# EAGLE design CircularDisplayPrototypingBoard (EAGLE 9.6.2)
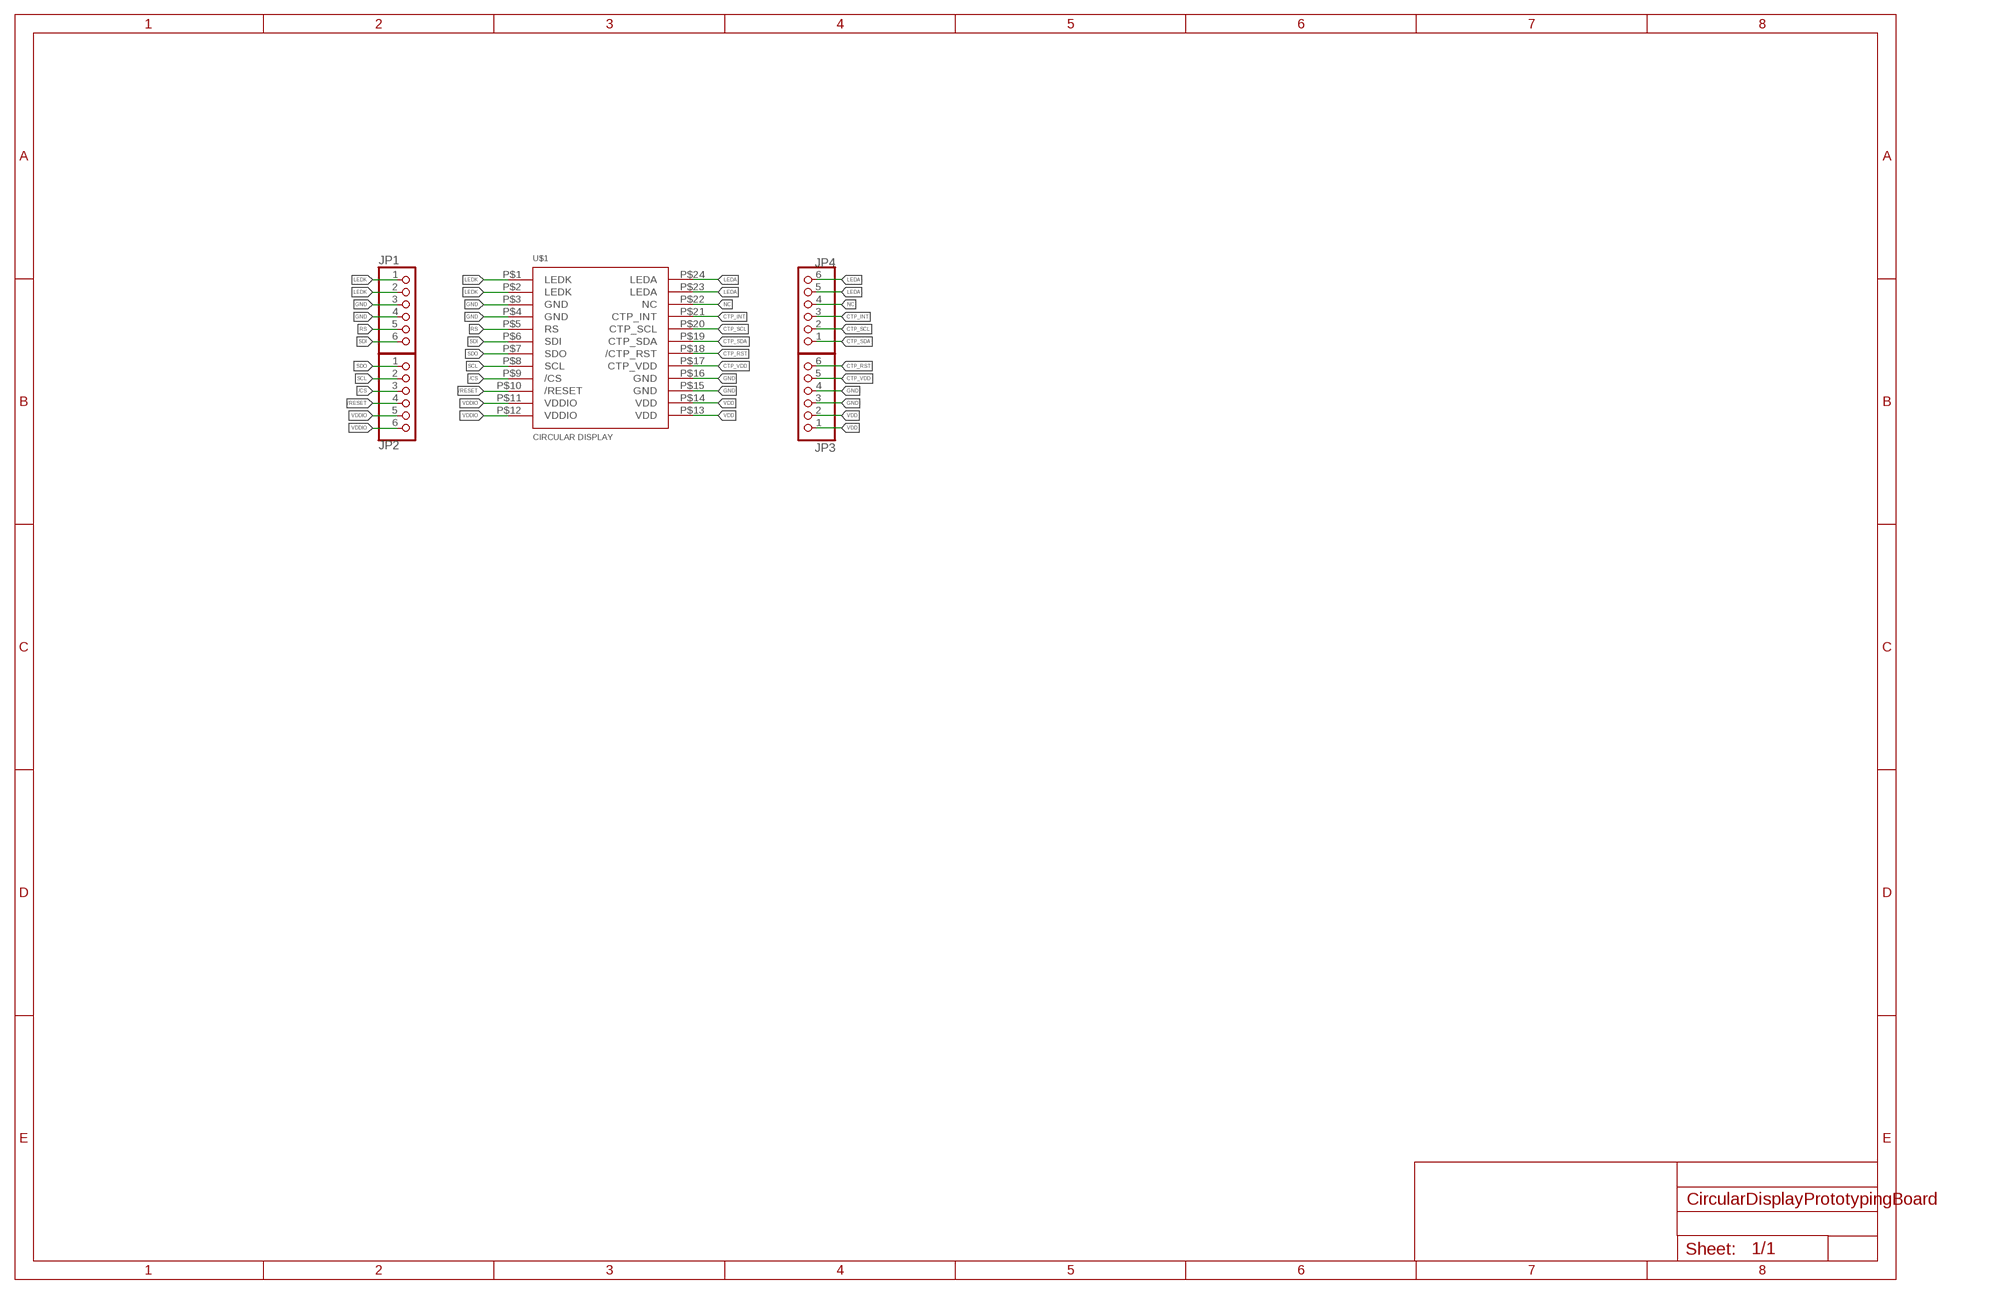
[diagram p0: schematic, sheet 1]

## Parts
JP1  PINHD-1X6  [1X06]
JP2  PINHD-1X6  [1X06]
JP3  PINHD-1X6  [1X06]
JP4  PINHD-1X6  [1X06]
U$1  CIRCULAR-DISPLAY-1  [CIRCULAR-DISPLAY-1]

## Nets
/CS: JP2.3 U$1.P$9(/CS)
/RESET: JP2.4 U$1.P$10(/RESET)
CTP_INT: JP4.3 U$1.P$21(CTP_INT)
CTP_RST: JP3.6 U$1.P$18(/CTP_RST)
CTP_SCL: JP4.2 U$1.P$20(CTP_SCL)
CTP_SDA: JP4.1 U$1.P$19(CTP_SDA)
CTP_VDD: JP3.5 U$1.P$17(CTP_VDD)
GND: JP1.3 JP1.4 JP3.3 JP3.4 U$1.P$3(GND) U$1.P$4(GND) U$1.P$15(GND) U$1.P$16(GND)
LEDA: JP4.5 JP4.6 U$1.P$23(LEDA) U$1.P$24(LEDA)
LEDK: JP1.1 JP1.2 U$1.P$1(LEDK) U$1.P$2(LEDK)
NC: JP4.4 U$1.P$22(NC)
RS: JP1.5 U$1.P$5(RS)
SCL: JP2.2 U$1.P$8(SCL)
SDI: JP1.6 U$1.P$6(SDI)
SDO: JP2.1 U$1.P$7(SDO)
VDD: JP3.1 JP3.2 U$1.P$13(VDD) U$1.P$14(VDD)
VDDIO: JP2.5 JP2.6 U$1.P$11(VDDIO) U$1.P$12(VDDIO)

## Library data of the parts
JP1-JP4 = adafruit:PINHD-1X6: PIN HEADER
U$1 = circular-display:CIRCULAR-DISPLAY-1

## Board
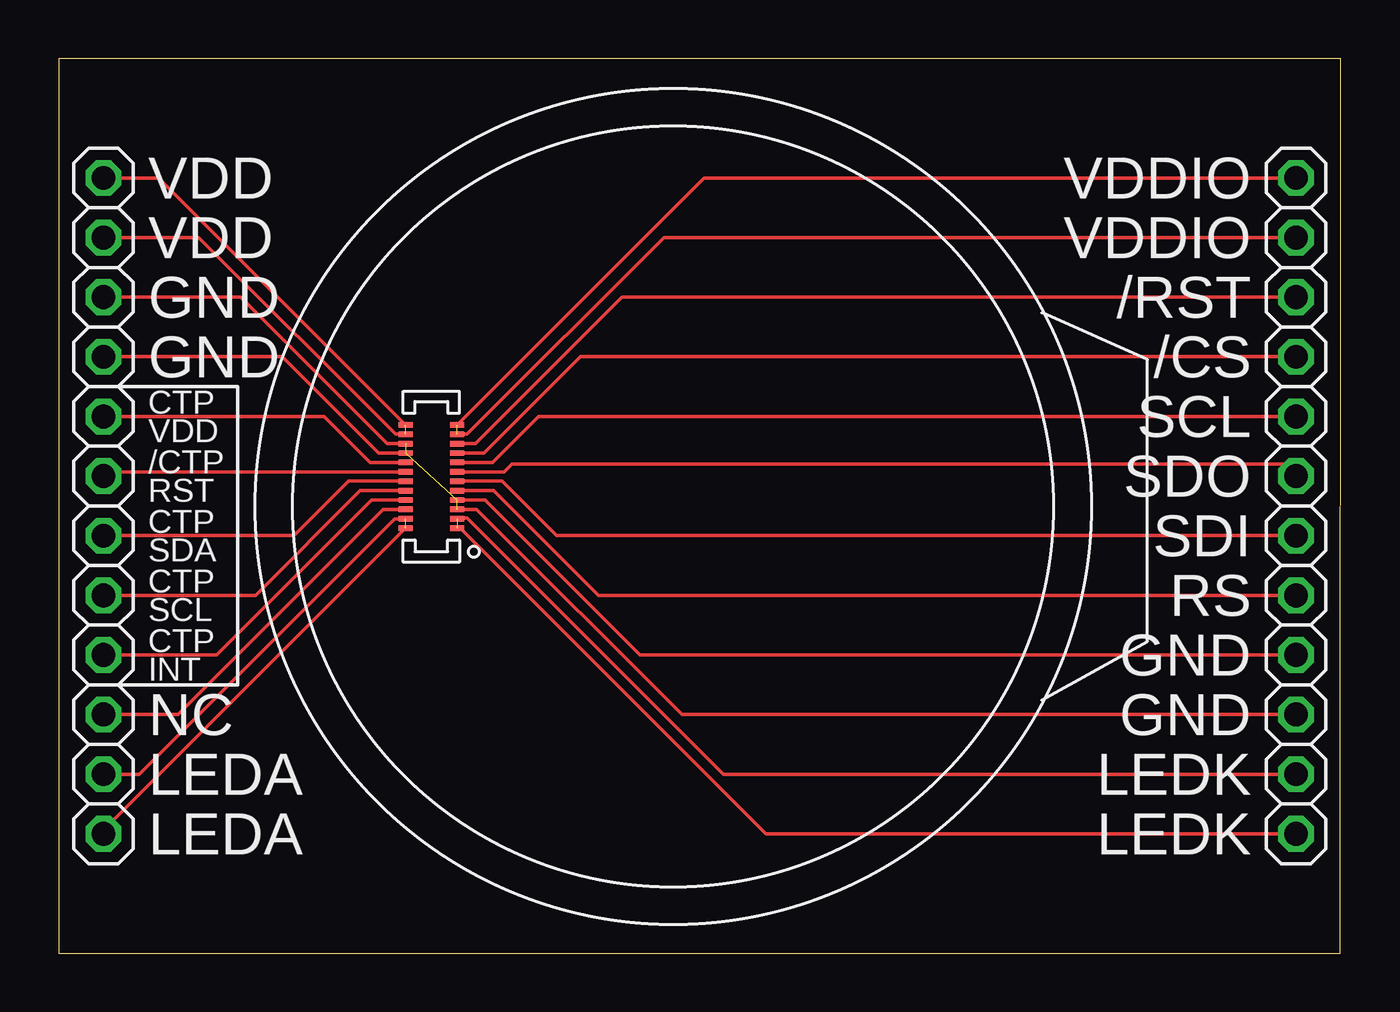
[diagram p1: board, top side]

Size 54.61 x 38.1 mm. Coordinates in mm from the lower left corner, seen from the top.
Outline: 0,0 54.59,0 54.61,38.1 0,38.1 0,0
Copper layers (1*16): Top 0.035mm / dielectric 1.5mm / Bottom 0.035mm
Design rules "default": minimum track width 6mil, minimum drill 0.35mm, track to track 6mil, track to pad 6mil, pad to pad 6mil, via to via 6mil, smd to smd 6mil, copper to edge 40mil, drill to drill 6mil, minimum pad ring 10mil, minimum via ring 8mil, stop-mask expansion 4mil, vias tented up to drill 0mil, thermal gap 10mil

### Footprints (pad centres in the part's own frame; a part is rotated, then mirrored left to right if it is on the bottom)
1X06 = drill 1.016 octagon: 1 -6.35,0; 2 -3.81,0; 3 -1.27,0; 4 1.27,0; 5 3.81,0; 6 6.35,0
CIRCULAR-DISPLAY-1 = smd 0.23 x 0.6: P$1 -0.95,-1.095; P$2 -0.55,-1.095; P$3 -0.15,-1.095; P$4 0.25,-1.095; P$5 0.65,-1.095; P$6 1.05,-1.095; P$7 1.45,-1.095; P$8 1.85,-1.095; P$9 2.25,-1.095; P$10 2.65,-1.095; P$11 3.05,-1.095; P$12 3.45,-1.095; P$13 3.45,1.095; P$14 3.05,1.095; P$15 2.65,1.095; P$16 2.25,1.095; P$17 1.85,1.095; P$18 1.45,1.095; P$19 1.05,1.095; P$20 0.65,1.095; P$21 0.25,1.095; P$22 -0.15,1.095; P$23 -0.55,1.095; P$24 -0.95,1.095

### Placement (x,y rotation side)
JP1  52.7,11.43 90 top
JP2  52.7,26.67 90 top
JP3  1.91,26.67 270 top
JP4  1.91,11.43 270 top
U$1  15.88,19.05 90 top

### Tracks (layer width: path | path; a pad name or v marks a point on that pad's centre or on a via)
/CS
  Top 0.152: U$1.P$9 18.12,21.3 22.23,25.4 JP2.3
/RESET
  Top 0.152: U$1.P$10 17.76,21.7 24,27.94 JP2.4
CTP_INT
  Top 0.152: U$1.P$21 13.33,19.3 6.73,12.7 JP4.3
CTP_RST
  Top 0.152: U$1.P$18 2.08,20.5 JP3.6
CTP_SCL
  Top 0.152: U$1.P$20 12.84,19.7 8.38,15.24 JP4.2
CTP_SDA
  Top 0.152: U$1.P$19 12.35,20.1 10.03,17.78 JP4.1
CTP_VDD
  Top 0.152: U$1.P$17 13.26,20.9 11.3,22.86 JP3.5
GND  (3 unrouted)
  Top 0.152: U$1.P$15 13.99,21.7 7.75,27.94 JP3.3 | U$1.P$16 13.62,21.3 9.53,25.4 JP3.4 | U$1.P$4 18.16,19.3 24.77,12.7 JP1.4 | U$1.P$3 17.8,18.9 26.54,10.16 JP1.3
LEDA  (1 unrouted)
  Top 0.152: U$1.P$24 1.91,5.22 JP4.6 | U$1.P$23 14.31,18.5 3.43,7.62 JP4.5
LEDK  (1 unrouted)
  Top 0.152: U$1.P$1 17.1,18.1 30.12,5.08 JP1.1 | U$1.P$2 17.01,18.54 17.4,18.54 28.32,7.62 JP1.2
NC
  Top 0.152: U$1.P$22 13.82,18.9 5.08,10.16 JP4.4
RS
  Top 0.152: U$1.P$5 18.53,19.7 22.99,15.24 JP1.5
SCL
  Top 0.152: U$1.P$8 18.49,20.9 20.45,22.86 JP2.2
SDI
  Top 0.152: U$1.P$6 18.89,20.1 21.21,17.78 JP1.6
SDO
  Top 0.152: U$1.P$7 18.98,20.5 19.3,20.83 52.2,20.83 JP2.1
VDD  (1 unrouted)
  Top 0.152: U$1.P$13 4.26,33.02 JP3.1 | U$1.P$14 14.35,22.1 5.97,30.48 JP3.2
VDDIO  (1 unrouted)
  Top 0.152: U$1.P$12 27.49,33.02 JP2.6 | U$1.P$11 17.4,22.1 25.78,30.48 JP2.5

### Text on the board
tPlace: VDD | VDDIO | VDD | VDDIO | GND | /RST | GND | /CS | CTP / VDD | SCL | /CTP / RST | SDO | CTP / SDA | SDI | CTP / SCL | RS | CTP / INT | GND | NC | GND | LEDA | LEDK | LEDA | LEDK